# Altium schematic sheet Mynd_BT.SchDoc: Mynd-BT
size A3; PageSetup: Record=PageOptions|CenterHorizontal=True|CenterVertical=True|PrintScale=0.70|XCorrection=1.00|YCorrection=1.00|PrintKind=0|BorderSize=5000000|LeftOffset=0|BottomOffset=0|Orientation=2|PaperLength=1000|PaperWidth=1000|Scale=100|PaperSource=7|PrintQuality=-4|MediaType=1|DitherType=10|PaperKind=A4|PrintScaleMode=1; ApprovedBy: JianHua.zhong; CheckedBy: Aileen.zhng; DrawnBy: GuoHui.Lin; Revision: 3.1; SheetNumber: 1; SheetTotal: 1; Model NO.: PS2307; ISSUE DATE: 20230812; REV DATE: 20231025
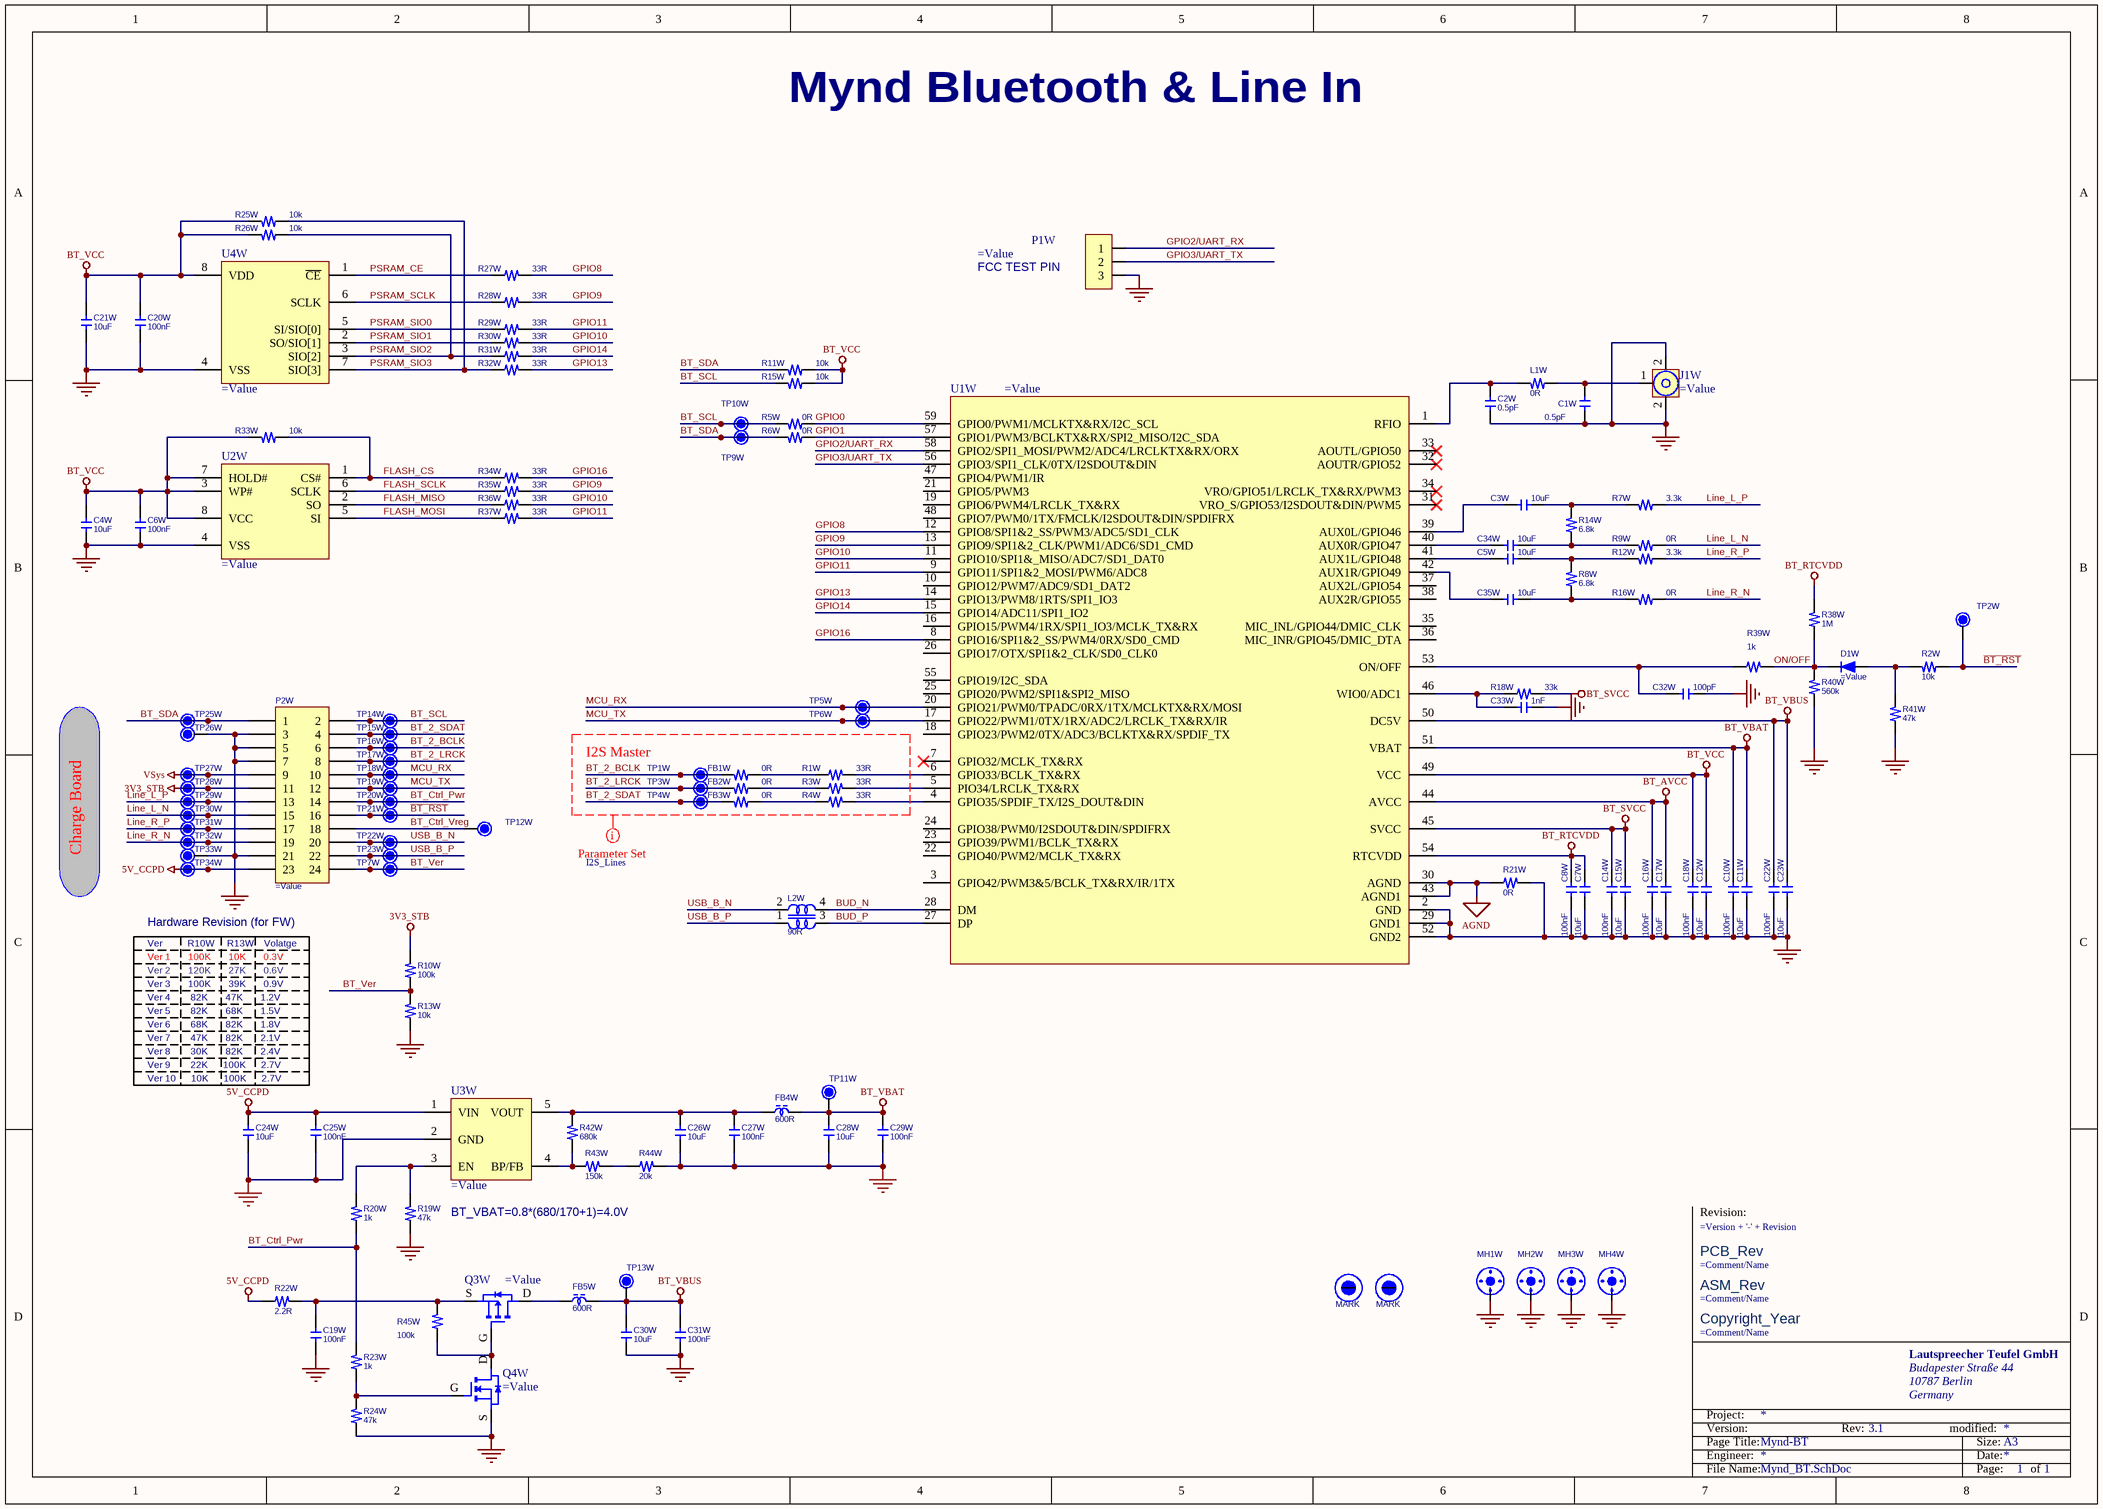
[diagram p0: Mynd_BT.SchDoc]

## Parts
C1W  0.5pF  [C0402]
C2W  0.5pF  [C0402]
C3W  10uF  [C0805_145]
C4W  10uF  [C0805_145]
C5W  10uF  [C0805_145]
C6W  100nF  [C0603X100]
C7W  10uF  [C0805_145]
C8W  100nF  [C0603X100]
C10W  100nF  [C0603X100]
C11W  10uF  [C0805_145]
C12W  10uF  [C0805_145]
C14W  100nF  [C0603X100]
C15W  10uF  [C0805_145]
C16W  100nF  [C0603X100]
C17W  10uF  [C0805_145]
C18W  100nF  [C0603X100]
C19W  100nF  [C0603X100]
C20W  100nF  [C0603X100]
C21W  10uF  [C0805_145]
C22W  100nF  [C0603X100]
C23W  10uF  [C0805_145]
C24W  10uF  [C0805_145]
C25W  100nF  [C0603X100]
C26W  10uF  [C0805_145]
C27W  100nF  [C0603X100]
C28W  10uF  [C0805_145]
C29W  100nF  [C0603X100]
C30W  10uF  [C0805_145]
C31W  100nF  [C0603X100]
C32W  100pF  [C0603X80]
C33W  1nF  [C0603X100]
C34W  10uF  [C0805_145]
C35W  10uF  [C0805_145]
D1W  (no value)  [SOD-323]
FB1W  0R  [R0603]
FB2W  0R  [R0603]
FB3W  0R  [R0603]
FB4W  600R  [L0603]
FB5W  600R  [L0603]
J1W  (no value)  [I-PEX MHF]
L1W  0R  [R0402]
L2W  90R  [COM_CHOKE_SMD_ICMF062P]
MH1W  SCREW_HOLE  [SCREW_D32]  (value not drawn)  (no BOM)
MH2W  SCREW_HOLE  [SCREW_D32]  (value not drawn)  (no BOM)
MH3W  SCREW_HOLE  [SCREW_D32]  (value not drawn)  (no BOM)
MH4W  SCREW_HOLE  [SCREW_D32]  (value not drawn)  (no BOM)
MK1W  MARK  [MARK]  (no BOM)
MK2W  MARK  [MARK]  (no BOM)
P1W  (no value)  [Pin_Header_SMD_S_T_254_3P]
P2W  (no value)  [Pin_Header_SMD_2X12_254]
Q3W  (no value)  [SOT23-GSD]
Q4W  (no value)  [SOT23-GSD]
R1W  33R  [R0603]
R2W  10k  [R0603]
R3W  33R  [R0603]
R4W  33R  [R0603]
R5W  0R  [R0603]
R6W  0R  [R0603]
R7W  3.3k  [R0603]
R8W  6.8k  [R0603]
R9W  0R  [R0603]
R10W  100k  [R0603]
R11W  10k  [R0603]
R12W  3.3k  [R0603]
R13W  10k  [R0603]
R14W  6.8k  [R0603]
R15W  10k  [R0603]
R16W  0R  [R0603]
R18W  33k  [R0603]
R19W  47k  [R0603]
R20W  1k  [R0603]
R21W  0R  [R0603]
R22W  2.2R  [R0805]
R23W  1k  [R0603]
R24W  47k  [R0603]
R25W  10k  [R0603]
R26W  10k  [R0603]
R27W  33R  [R0603]
R28W  33R  [R0603]
R29W  33R  [R0603]
R30W  33R  [R0603]
R31W  33R  [R0603]
R32W  33R  [R0603]
R33W  10k  [R0603]
R34W  33R  [R0603]
R35W  33R  [R0603]
R36W  33R  [R0603]
R37W  33R  [R0603]
R38W  1M  [R0603]
R39W  1k  [R0603]
R40W  560k  [R0603]
R41W  47k  [R0603]
R42W  680k  [R0603]
R43W  150k  [R0603]
R44W  20k  [R0603]
R45W  100k  [R0402]
Teufel_ASM_Label1W  (no value)  [Teufel_ASM_Rev]  (no BOM)
Teufel_Copyright1W  (no value)  [TEUFEL_COPYRIGHT]  (no BOM)
Teufel_PCB_Label1W  (no value)  [Teufel_PCB_Rev]  (no BOM)
Teufel_PCB_Logo1W  (no value)  [Teufel_NoLogo]  (no BOM)
TP1W  TP12  [TP120]  (value not drawn)  (no BOM)
TP2W  TP12  [TP120]  (value not drawn)  (no BOM)
TP3W  TP12  [TP120]  (value not drawn)  (no BOM)
TP4W  TP12  [TP120]  (value not drawn)  (no BOM)
TP5W  TP12  [TP120]  (value not drawn)  (no BOM)
TP6W  TP12  [TP120]  (value not drawn)  (no BOM)
TP7W  TP12  [TP120]  (value not drawn)  (no BOM)
TP9W  TP12  [TP120]  (value not drawn)  (no BOM)
TP10W  TP12  [TP120]  (value not drawn)  (no BOM)
TP11W  TP06  [TP060]  (value not drawn)  (no BOM)
TP12W  TP12  [TP120]  (value not drawn)  (no BOM)
TP13W  TP06  [TP060]  (value not drawn)  (no BOM)
TP14W  TP12  [TP120]  (value not drawn)  (no BOM)
TP15W  TP12  [TP120]  (value not drawn)  (no BOM)
TP16W  TP12  [TP120]  (value not drawn)  (no BOM)
TP17W  TP12  [TP120]  (value not drawn)  (no BOM)
TP18W  TP12  [TP120]  (value not drawn)  (no BOM)
TP19W  TP12  [TP120]  (value not drawn)  (no BOM)
TP20W  TP12  [TP120]  (value not drawn)  (no BOM)
TP21W  TP12  [TP120]  (value not drawn)  (no BOM)
TP22W  TP12  [TP120]  (value not drawn)  (no BOM)
TP23W  TP12  [TP120]  (value not drawn)  (no BOM)
TP25W  TP12  [TP120]  (value not drawn)  (no BOM)
TP26W  TP12  [TP120]  (value not drawn)  (no BOM)
TP27W  TP12  [TP120]  (value not drawn)  (no BOM)
TP28W  TP12  [TP120]  (value not drawn)  (no BOM)
TP29W  TP12  [TP120]  (value not drawn)  (no BOM)
TP30W  TP12  [TP120]  (value not drawn)  (no BOM)
TP31W  TP12  [TP120]  (value not drawn)  (no BOM)
TP32W  TP12  [TP120]  (value not drawn)  (no BOM)
TP33W  TP12  [TP120]  (value not drawn)  (no BOM)
TP34W  TP12  [TP120]  (value not drawn)  (no BOM)
U1W  (no value)  [BT_59P_L260XW150XH26_P105]
U2W  (no value)  [SO_8_200]
U3W  (no value)  [SOT23-5]
U4W  (no value)  [SO-8]

## Nets
3V3_STB: P2W.11 R10W.1 TP28W.1
5V_CCPD: C24W.1 C25W.2 P2W.23 R22W.2 TP34W.1 U3W.1(VIN)
AGND: R21W.2 U1W.30(AGND) U1W.43(AGND1)
BT_AVCC: C16W.1 C17W.2 U1W.44(AVCC)
BT_RTCVDD: C7W.1 C8W.1 R38W.1 U1W.54(RTCVDD)
BT_SVCC: C14W.1 C15W.2 R18W.1 U1W.45(SVCC)
BT_VBAT: C10W.2 C11W.2 C28W.1 C29W.2 FB4W.2 TP11W.1 U1W.51(VBAT)
BT_VBUS: C22W.1 C23W.1 C30W.2 C31W.2 FB5W.2 TP13W.1 U1W.50(DC5V)
BT_VCC: C4W.2 C6W.2 C12W.2 C18W.2 C20W.1 C21W.1 R11W.1 R15W.1 R25W.1 R26W.1 R33W.1 U1W.49(VCC) U2W.3(WP#) U2W.7(HOLD#) U2W.8(VCC) U4W.8(VDD)
GND: C1W.2 C2W.2 C4W.1 C6W.1 C7W.2 C8W.2 C10W.1 C11W.1 C12W.1 C14W.2 C15W.1 C16W.2 C17W.1 C18W.1 C19W.2 C20W.2 C21W.2 C22W.2 C23W.2 C24W.2 C25W.1 C26W.2 C27W.1 C28W.2 C29W.1 C30W.1 C31W.1 C32W.1 C33W.1 J1W.2(IN) MH1W.1 MH2W.1 MH3W.1 MH4W.1 P1W.3 P2W.3 P2W.5 P2W.7 P2W.21 Q4W.S R13W.2 R19W.2 R21W.1 R24W.2 R40W.2 R41W.2 R44W.1 TP26W.1 TP33W.1 U1W.2(GND) U1W.29(GND1) U1W.52(GND2) U2W.4(VSS) U3W.2(GND) U4W.4(VSS)
VSys: P2W.9 TP27W.1
~{BT_RST}: P2W.16 R2W.2 TP2W.1 TP21W.1
BT_2_BCLK: FB1W.1 P2W.6 TP1W.1 TP16W.1
BT_2_LRCK: FB2W.1 P2W.8 TP3W.1 TP17W.1
BT_2_SDAT: FB3W.1 P2W.4 TP4W.1 TP15W.1
BT_Ctrl_Pwr: P2W.14 R20W.2 R23W.1 TP20W.1
BT_Ctrl_Vreg: P2W.18 TP12W.1
BT_SCL: P2W.2 R5W.1 R15W.2 TP10W.1 TP14W.1
BT_SDA: P2W.1 R6W.1 R11W.2 TP9W.1 TP25W.1
BT_Ver: P2W.24 R10W.2 R13W.1 TP7W.1
BUD_N: L2W.4 U1W.28(DM)
BUD_P: L2W.3 U1W.27(DP)
FLASH_CS: R33W.2 R34W.2 U2W.1(CS#)
FLASH_MISO: R36W.2 U2W.2(SO)
FLASH_MOSI: R37W.2 U2W.5(SI)
FLASH_SCLK: R35W.2 U2W.6(SCLK)
GPIO0: R5W.2 U1W.59(GPIO0/PWM1/MCLKTX&RX/I2C_SCL)
GPIO1: R6W.2 U1W.57(GPIO1/PWM3/BCLKTX&RX/SPI2_MISO/I2C_SDA)
GPIO2/UART_RX: P1W.1 U1W.58(GPIO2/SPI1_MOSI/PWM2/ADC4/LRCLKTX&RX/ORX)
GPIO3/UART_TX: P1W.2 U1W.56(GPIO3/SPI1_CLK/0TX/I2SDOUT&DIN)
GPIO8: R27W.1 U1W.12(GPIO8/SPI1&2_SS/PWM3/ADC5/SD1_CLK)
GPIO9: R28W.1 R35W.1 U1W.13(GPIO9/SPI1&2_CLK/PWM1/ADC6/SD1_CMD)
GPIO10: R30W.1 R36W.1 U1W.11(GPIO10/SPI1&_MISO/ADC7/SD1_DAT0)
GPIO11: R29W.1 R37W.1 U1W.9(GPIO11/SPI1&2_MOSI/PWM6/ADC8)
GPIO13: R32W.1 U1W.14(GPIO13/PWM8/1RTS/SPI1_IO3)
GPIO14: R31W.1 U1W.15(GPIO14/ADC11/SPI1_IO2)
GPIO16: R34W.1 U1W.8(GPIO16/SPI1&2_SS/PWM4/0RX/SD0_CMD)
Line_L_N: P2W.15 R9W.2 TP30W.1
Line_L_P: P2W.13 R7W.2 TP29W.1
Line_R_N: P2W.19 R16W.2 TP32W.1
Line_R_P: P2W.17 R12W.2 TP31W.1
MCU_RX: P2W.10 TP5W.1 TP18W.1 U1W.20(GPIO21/PWM0/TPADC/0RX/1TX/MCLKTX&RX/MOSI)
MCU_TX: P2W.12 TP6W.1 TP19W.1 U1W.17(GPIO22/PWM1/0TX/1RX/ADC2/LRCLK_TX&RX/IR)
ON/OFF: D1W.K R38W.2 R39W.1 R40W.1
PSRAM_CE: R27W.2 U4W.1(~{CE})
PSRAM_SCLK: R28W.2 U4W.6(SCLK)
PSRAM_SIO0: R29W.2 U4W.5(SI/SIO[0])
PSRAM_SIO1: R30W.2 U4W.2(SO/SIO[1])
PSRAM_SIO2: R26W.2 R31W.2 U4W.3(SIO[2])
PSRAM_SIO3: R25W.2 R32W.2 U4W.7(SIO[3])
USB_B_N: L2W.2 P2W.20 TP22W.1
USB_B_P: L2W.1 P2W.22 TP23W.1
NetC1W_1: C1W.1 J1W.1(OUT) L1W.1
NetC2W_1: C2W.1 L1W.2 U1W.1(RFIO)
NetC3W_1: C3W.1 U1W.39(AUX0L/GPIO46)
NetC3W_2: C3W.2 R7W.1 R14W.2
NetC5W_1: C5W.1 U1W.41(AUX1L/GPIO48)
NetC5W_2: C5W.2 R8W.2 R12W.1
NetC19W_1: C19W.1 Q3W.S R22W.1 R45W.1
NetC26W_1: C26W.1 C27W.2 FB4W.1 R42W.1 U3W.5(VOUT)
NetC32W_2: C32W.2 R39W.2 U1W.53(ON/OFF)
NetC33W_2: C33W.2 R18W.2 U1W.46(WIO0/ADC1)
NetC34W_1: C34W.1 U1W.40(AUX0R/GPIO47)
NetC34W_2: C34W.2 R9W.1 R14W.1
NetC35W_1: C35W.1 U1W.42(AUX1R/GPIO49)
NetC35W_2: C35W.2 R8W.1 R16W.1
NetD1W_A: D1W.A R2W.1 R41W.1
NetFB1W_2: FB1W.2 R1W.2
NetFB2W_2: FB2W.2 R3W.2
NetFB3W_2: FB3W.2 R4W.2
NetFB5W_1: FB5W.1 Q3W.D
NetQ3W_G: Q3W.G Q4W.D R45W.2
NetQ4W_G: Q4W.G R23W.2 R24W.1
NetR1W_1: R1W.1 U1W.6(GPIO33/BCLK_TX&RX)
NetR3W_1: R3W.1 U1W.5(PIO34/LRCLK_TX&RX)
NetR4W_1: R4W.1 U1W.4(GPIO35/SPDIF_TX/I2S_DOUT&DIN)
NetR19W_1: R19W.1 R20W.1 U3W.3(EN)
NetR42W_2: R42W.2 R43W.2 U3W.4(BP/FB)
NetR43W_1: R43W.1 R44W.2

Not connected (* = marked no-connect by the designer): MK1W MK_B MK_T; MK2W MK_B MK_T; U1W 3(GPIO42/PWM3&5/BCLK_TX&RX/IR/1TX) 7(GPIO32/MCLK_TX&RX)* 10(GPIO12/PWM7/ADC9/SD1_DAT2) 16(GPIO15/PWM4/1RX/SPI1_IO3/MCLK_TX&RX) 18(GPIO23/PWM2/0TX/ADC3/BCLKTX&RX/SPDIF_TX) 19(GPIO6/PWM4/LRCLK_TX&RX) 21(GPIO5/PWM3) 22(GPIO40/PWM2/MCLK_TX&RX) 23(GPIO39/PWM1/BCLK_TX&RX) 24(GPIO38/PWM0/I2SDOUT&DIN/SPDIFRX) 25(GPIO20/PWM2/SPI1&SPI2_MISO) 26(GPIO17/OTX/SPI1&2_CLK/SD0_CLK0) 31(VRO_S/GPIO53/I2SDOUT&DIN/PWM5)* 32(AOUTR/GPIO52)* 33(AOUTL/GPIO50)* 34(VRO/GPIO51/LRCLK_TX&RX/PWM3)* 35(MIC_INL/GPIO44/DMIC_CLK) 36(MIC_INR/GPIO45/DMIC_DTA) 37(AUX2L/GPIO54) 38(AUX2R/GPIO55) 47(GPIO4/PWM1/IR) 48(GPIO7/PWM0/1TX/FMCLK/I2SDOUT&DIN/SPDIFRX) 55(GPIO19/I2C_SDA)

## Layout directives
net class I2S_Lines: BT_2_BCLK, BT_2_LRCK, BT_2_SDAT

## Notes on the sheet
- Mynd Bluetooth & Line In
- FCC TEST PIN
- I2S Master
- Charge Board
- Ver 1       100K       10K       0.3V
- Ver          R10W     R13W    Volatge
- Hardware Revision (for FW)
- Ver 2       120K       27K       0.6V
- Ver 3       100K       39K       0.9V
- Ver 4        82K       47K       1.2V
- Ver 5        82K       68K       1.5V
- Ver 6        68K       82K       1.8V
- Ver 7        47K       82K       2.1V
- Ver 8        30K       82K       2.4V
- Ver 9        22K      100K      2.7V
- Ver 10      10K      100K      2.7V
- BT_VBAT=0.8*(680/170+1)=4.0V
- Revision:
- Lautspreecher Teufel GmbH
- Budapester Straße 44
- 10787 Berlin
- Germany
- Page Title:
- Engineer:
- Project:
- Version:
- Rev:
- modified:
- Date:
- Size:
- A3
- File Name:
- Page:
- of
- (in symbol CMP-00086-3) Copyright_Year
- (in symbol CMP-00087-3) PCB_Rev
- (in symbol CMP-00088-3) ASM_Rev

## Library data of the parts
C1W C2W = P-001-0057-31: GP SMD M CAP 0.5pF 50V ±0.1pF 0402 NPO; Manufacturer: Multi Sourced; Part_Number: Generic; Part_Type: Capacitor SMT; Tolerance: ±0.1pF; Voltage: 50V; Value: 0.5pF; Temp_Coefficient: NPO
C3W C4W C5W C7W C11W C12W C15W C17W C21W C23W C30W C34W C35W = P-001-0158-27: PSHF SMD M CAP 10uF 16V ±10% 0805 X7R; Manufacturer: Multi Sourced; Part_Number: Generic; Part_Type: Capacitor SMT; Tolerance: ±10% 0805; Voltage: 16V; Value: 10uF; Temp_Coefficient: X7R
C6W C8W C10W C14W C16W C18W C19W C20W C22W C27W C29W C31W = P-001-0038-26: PSHF SMD M CAP 100nF 16V ±10%  0603 X7R; Manufacturer: Multi Sourced; Part_Number: Generic; Part_Type: Capacitor SMT; Tolerance: ±10%; Voltage: 16V; Value: 100nF; Temp_Coefficient: X7R
C24W C26W C28W = P-001-0136-18: PSHF SMD M CAP 10uF 16V ±10% 0805 0805 X5R; Manufacturer: Multi Sourced; Part_Number: Generic; Part_Type: Capacitor SMT; Tolerance: ±10% 0805; Voltage: 16V; Value: 10uF; Temp_Coefficient: X5R
C25W = P-001-0074-61: PSHF SMD M CAP 100nF 50V ±10% 0603 X7R; Manufacturer: Multi Sourced; Part_Number: Generic; Part_Type: Capacitor SMT; Voltage: 50V; Tolerance: ±10%; Value: 100nF; Temp_Coefficient: X7R
C32W = P-001-0637-10: PSHF SMD M CAP 100pF 50V ±10% 0603 X7R; Manufacturer: Multi Sourced; Part_Number: Generic; Part_Type: Capacitor SMT; Voltage: 50V; Tolerance: ±10%; Value: 100pF; Temp_Coefficient: X7R
C33W = P-001-0073-48: PSHF SMD M CAP 1nF 50V ±10% 0603 X7R; Manufacturer: Multi Sourced; Part_Number: Generic; Part_Type: Capacitor SMT; Voltage: 50V; Tolerance: ±10%; Value: 1nF; Temp_Coefficient: X7R
D1W = R-001-0139-19: PS SMD DIODE 2P 100V SOD323 1N4148 CJ; Manufacturer: [CJ]; Part_Type: Semiconductor Diode SMT; Current: 150mA; Part_Number: 1N4148; Value: 1N4148; Voltage: 100V
FB1W FB2W FB3W = Q-001-0048-204: GPHF SMD RES. 0OHM 1/10W 5% 0603; Manufacturer: Multi Sourced; Part_Number: Generic; Part_Type: Resistor SMT; Tolerance: 5%; Wattage: 1/10W; Value: 0R
FB4W FB5W = S-001-0006-21: PS SMD FERRITE BEAD 600OHM 25% 0603; Manufacturer: [TSA]; Part_Number: FCM1608KF-601T05; Part_Type: Ferrite Bead SMT; Current: 0.5A; Tolerance: 1:25%; Frequency: 100MHz; Value: 600R
J1W = C-001-0134-11: SMD ANTENNA JACK 2P FEMALE; Manufacturer: [SONGCHENG]; Part_Number: 9181-000030; Part_Type: Connector U.FL SMT; System: Connector; Value: 9181-000030
L1W = Q-001-0330-113: GPHF SMD RES. 0OHM 1/16W 5% 0402; Manufacturer: Multi Sourced; Part_Number: Generic; Part_Type: Resistor SMT; Tolerance: 5%; Wattage: 1/16W; Value: 0R
L2W = J-001-0121-2: FILTER ICMF062P900MFR 100MHz 4P 90ohm; Manufacturer: TSA; Part_Type: Inductor Common Mode SMT; Part_Number: ICMF062P900MFR; Frequency: 100MHz; Value: 90R
MH1W MH2W MH3W MH4W = N-001-00005-4: SCREW_HOLE D3.2mm; Design Item ID: SCREW_HOLE
MK1W MK2W = N-001-00003-2: MARK DOT; Design Item ID: MARK
P1W = C-001-0512-9: GP HEADER PIN 3P P=2.54mm 90° GOLD; Part_Number: Header 3P PITCH=2.54mm SMT; Part_Type: Connector 1 x 3P 2.54mm SMT; Value: Header 3P PITCH=2.54mm SMT
P2W = C-001-1094-3: SMD BTB CONNECTOR 24P P2.54mm GOLD; Manufacturer: MINGHENG; Part_Number: Connector 2 x 12P 2.54mm SMT; Part_Type: Connector 2 x12P 2.54mm SMT; Value: Connector 2 x 12P 2.54mm SMT; System: Connector
Q3W = R-001-1323-4: GS SMD FET 3P -30V SOT-23 CJ3401 CJ; Manufacturer: [CJ]; Part_Type: Semiconductor Transistor SMT; Current: -4.2V; Part_Number: CJ3401; Value: CJ3401; Voltage: -30V
Q4W = R-001-0217-29: GP SMD FET 3P SOT23 2N7002K CTE; Part_Type: Semiconductor Transistor SMT; Current: 300MA; Voltage: 60V; Manufacturer: CTE; Part_Number: 2N7002K; Value: 2N7002K
R1W R3W R4W R27W R28W R29W R30W R31W R32W R34W R35W R36W R37W = Q-001-0059-28: PS SMD RES. 33OHM 1/10W 5% 0603; Manufacturer: Multi Sourced; Part_Number: Generic; Part_Type: Resistor SMT; Tolerance: 5%; Wattage: 1/10W; Value: 33R
R2W R11W R15W R25W R26W R33W = Q-001-0036-48: PS SMD RES. 10KOHM 1/10W 1% 0603; Manufacturer: Multi Sourced; Part_Number: Generic; Part_Type: Resistor SMT; Tolerance: 1%; Wattage: 1/10W; Value: 10k
R5W R6W R9W R16W R21W = Q-001-0048-200: PS SMD RES. 0OHM 1/10W 5% 0603; Manufacturer: Multi Sourced; Part_Number: Generic; Part_Type: Resistor SMT; Tolerance: 5%; Wattage: 1/10W; Value: 0R
R7W R12W = Q-001-0389-23: GPHF SMD RES. 3.3KOHM 1/10W 1% 0603; Manufacturer: Multi Sourced; Part_Number: Generic; Part_Type: Resistor SMT; Tolerance: 1%; Wattage: 1/10W; Value: 3.3k
R8W R14W = Q-001-0483-19: PS SMD RES. 6.8KOHM 1/10W 1% 0603; Part_Type: Resistor SMT; Manufacturer: Multi Sourced; Part_Number: Generic; Temp_Coefficient: 150ppm; Tolerance: 1%; Value: 6.8k; Wattage: 1/10W
R10W = Q-001-0032-56: GPHF SMD RES. 100KOHM 1/10W 1% 0603; Manufacturer: Multi Sourced; Part_Number: Generic; Part_Type: Resistor SMT; Tolerance: 1%; Wattage: 1/10W; Value: 100k
R13W = Q-001-0036-51: GPHF SMD RES. 10KOHM 1/10W 1% 0603; Manufacturer: Multi Sourced; Part_Number: Generic; Part_Type: Resistor SMT; Tolerance: 1%; Wattage: 1/10W; Value: 10k
R18W = Q-001-0388-42: PS SMD RES. 33KOHM 1/10W 1% 0603; Manufacturer: Multi Sourced; Part_Number: Generic; Part_Type: Resistor SMT; Tolerance: 1%; Wattage: 1/10W; Value: 33k
R19W R24W = Q-001-0439-19: PS SMD RES. 47KOHM 1/10W 1% 0603; Part_Type: Resistor SMT; Manufacturer: Multi Sourced; Part_Number: Generic; Temp_Coefficient: 150ppm; Tolerance: 1%; Value: 47k; Wattage: 1/10W
R20W R23W = Q-001-0033-26: PS SMD RES. 1KOHM 1/10W 1% 0603; Part_Type: Resistor SMT; Manufacturer: Multi Sourced; Part_Number: Generic; Temp_Coefficient: 150ppm; Tolerance: 1%; Value: 1k; Wattage: 1/10W
R22W = Q-001-0681-35: PS SMD RES. 2.2OHM 1/8W 5% 0805; Manufacturer: Multi Sourced; Part_Number: Generic; Part_Type: Resistor SMT; Tolerance: 5%; Wattage: 1/8W; Value: 2.2R
R38W = Q-001-0044-19: PS SMD RES. 1MOHM 1/10W 1% 0603; Manufacturer: Multi Sourced; Part_Number: Generic; Part_Type: Resistor SMT; Tolerance: 1%; Wattage: 1/10W; Value: 1M
R39W = Q-001-0033-26: PS SMD RES. 1KOHM 1/10W 1% 0603; Manufacturer: Multi Sourced; Part_Number: Generic; Part_Type: Resistor SMT; Tolerance: 1%; Wattage: 1/10W; Value: 1k
R40W = Q-001-0103-19: PS SMD RES. 560KOHM 1/10W 5% 0603; Manufacturer: Multi Sourced; Part_Number: Generic; Part_Type: Resistor SMT; Tolerance: 5%; Wattage: 1/10W; Value: 560k
R41W = Q-001-0439-19: PS SMD RES. 47KOHM 1/10W 1% 0603; Manufacturer: Multi Sourced; Part_Number: Generic; Part_Type: Resistor SMT; Tolerance: 1%; Wattage: 1/10W; Value: 47k
R42W = Q-001-0105-18: PS SMD RES. 680KOHM 1/10W 5% 0603; Manufacturer: Multi Sourced; Part_Number: Generic; Part_Type: Resistor SMT; Tolerance: 5%; Wattage: 1/10W; Value: 680k
R43W = Q-001-0318-20: PS SMD RES. 150KOHM 1/10W 1% 0603; Part_Number: Generic; Manufacturer: Multi Sourced; Part_Type: Resistor SMT; Tolerance: 1%; Wattage: 1/10W; Value: 150k
R44W = Q-001-0323-26: PS SMD RES. 20KOHM 1/10W 1% 0603; Part_Number: Generic; Manufacturer: Multi Sourced; Part_Type: Resistor SMT; Tolerance: 1%; Wattage: 1/10W; Value: 20k
R45W = Q-001-0260-39: GPHF SMD RES. 100KOHM 1/16W 1% 0402; Manufacturer: Multi Sourced; Part_Number: Generic; Part_Type: Resistor SMT; Tolerance: 1%; Wattage: 1/16W; Value: 100k
Teufel_ASM_Label1W = CMP-00088-3: Teufel_ASM_Rev
Teufel_Copyright1W = CMP-00086-3: Teufel_Copyright_Year
Teufel_PCB_Label1W = CMP-00087-3: Teufel_PCB_Label
Teufel_PCB_Logo1W = Teufel NoLogo: Teufel PCB NoLogo
TP1W TP2W TP3W TP4W TP5W TP6W TP9W TP10W TP12W = N-001-00010-2: Test Point; Design Item ID: TP
TP7W TP14W TP15W TP16W TP17W TP18W TP19W TP20W TP21W TP22W TP23W TP25W TP26W TP27W TP28W TP29W TP30W TP31W TP32W TP33W TP34W = N-001-00010-1: Test Point; Design Item ID: TP
TP11W TP13W = N-001-00007-3: Test Point; Design Item ID: TP
U1W = W-001-0416-7: BT MODULE 59P WB-2835P WORLDELITE; Part_Type: Semiconductor Module BT SMT; Manufacturer: WORLDELITE; Part_Number: WB-2835P; Value: WB-2835P
U2W = AIC-001-0049-3: PS SMD IC 8P SOP EN25QH64A EON; Part_Type: Semiconductor Integrated Circuit SMT; Value: RCI025064-B000; Part_Number: RCI025064-B000
U3W = R-001-0433-16: GP SMD IC 5P SC70 SGM2036-ADJYN5G/TR SGMICRO; Manufacturer: [SGMICRO]; Part_Type: Semiconductor Integrated Circuit SMT; Part_Number: SGM2036-ADJYN5G/TR; Value: SGM2036-ADJYN5G/TR
U4W = CMP-00090-1: QSPI PSRAM; Part_Type: Semiconductor Integrated Circuit SMT; Manufacturer: APS; Value: APS6404L-3SQN; Part_Number: APS6404L-3SQN